# EasyEDA Pro project NavBot-EN01.epro, schematic OLED

## Sheets
1 P1: Board Name: OLED; Create Date: 2025-05-19; Page Name: P1; Project Name: NavBot-EN01; Schematic Name: Schematic1; Update Date: 2025-06-04; Company: 嘉立创EDA; Page Size: A4; Version: V1.0
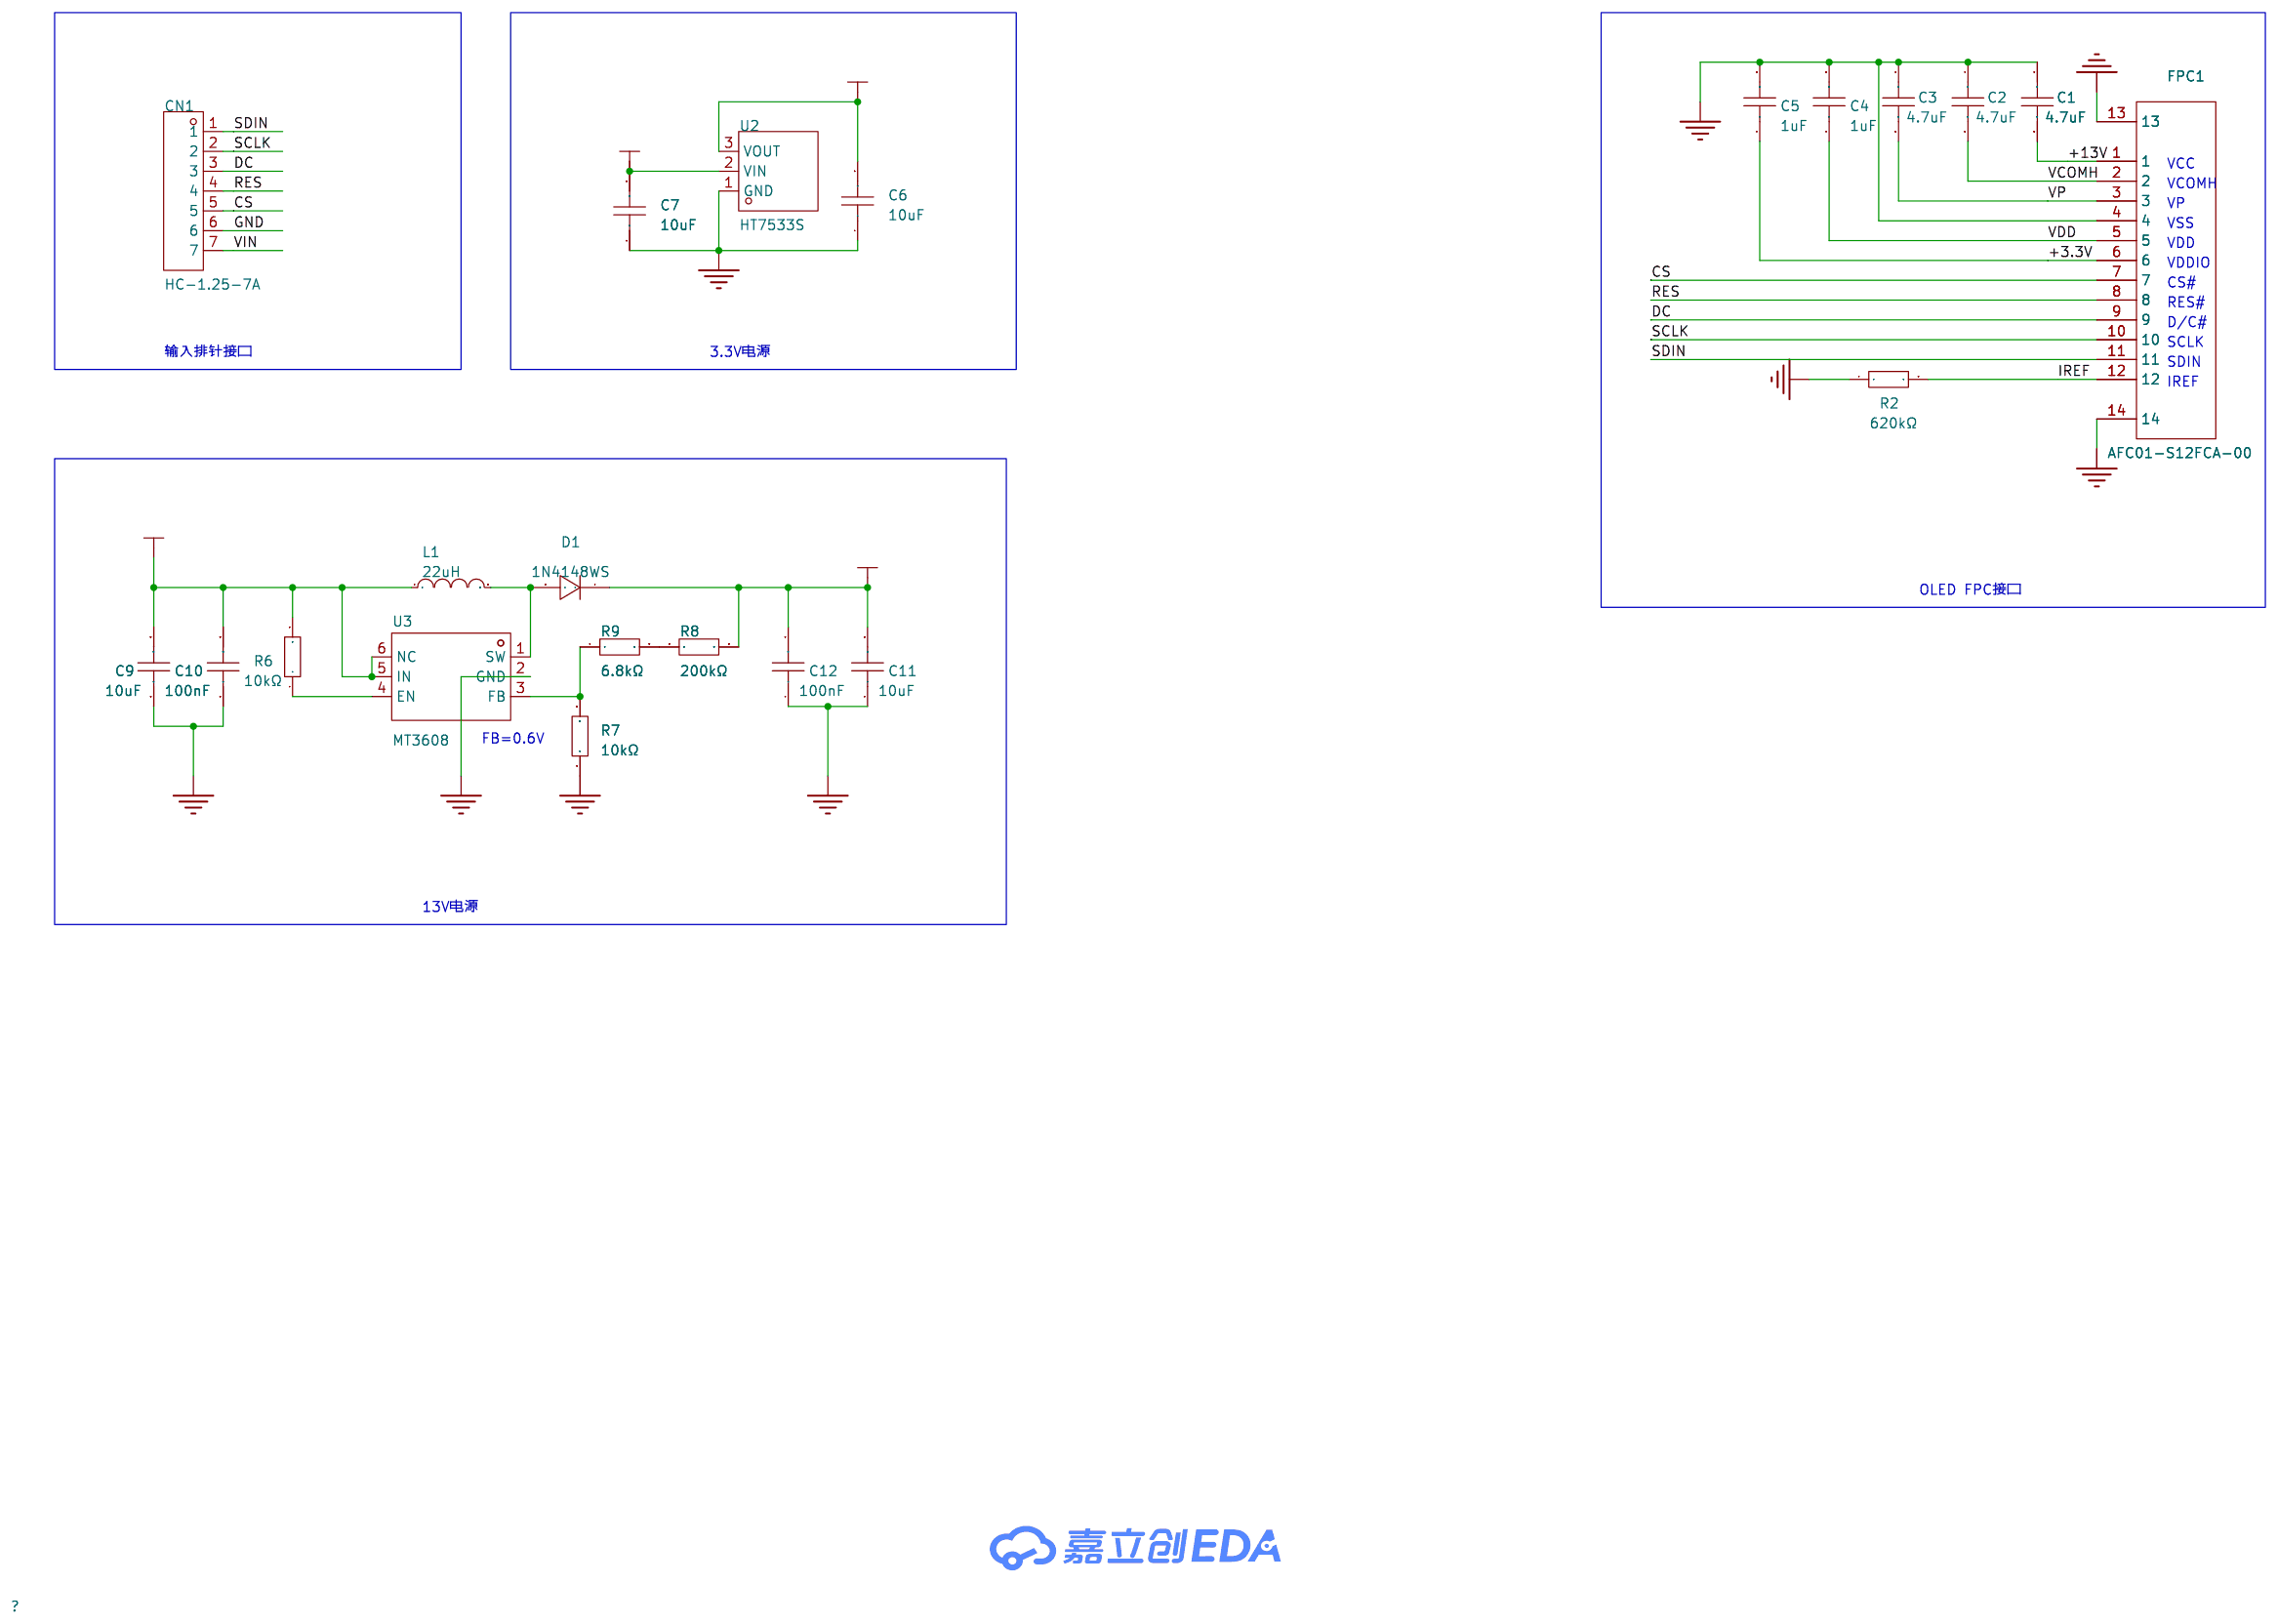
[diagram p2: P1]
2 版本说明: Create Date: 2025-07-21; Page Name: 版本说明; Schematic Name: OLED; Update Date: 2025-07-21
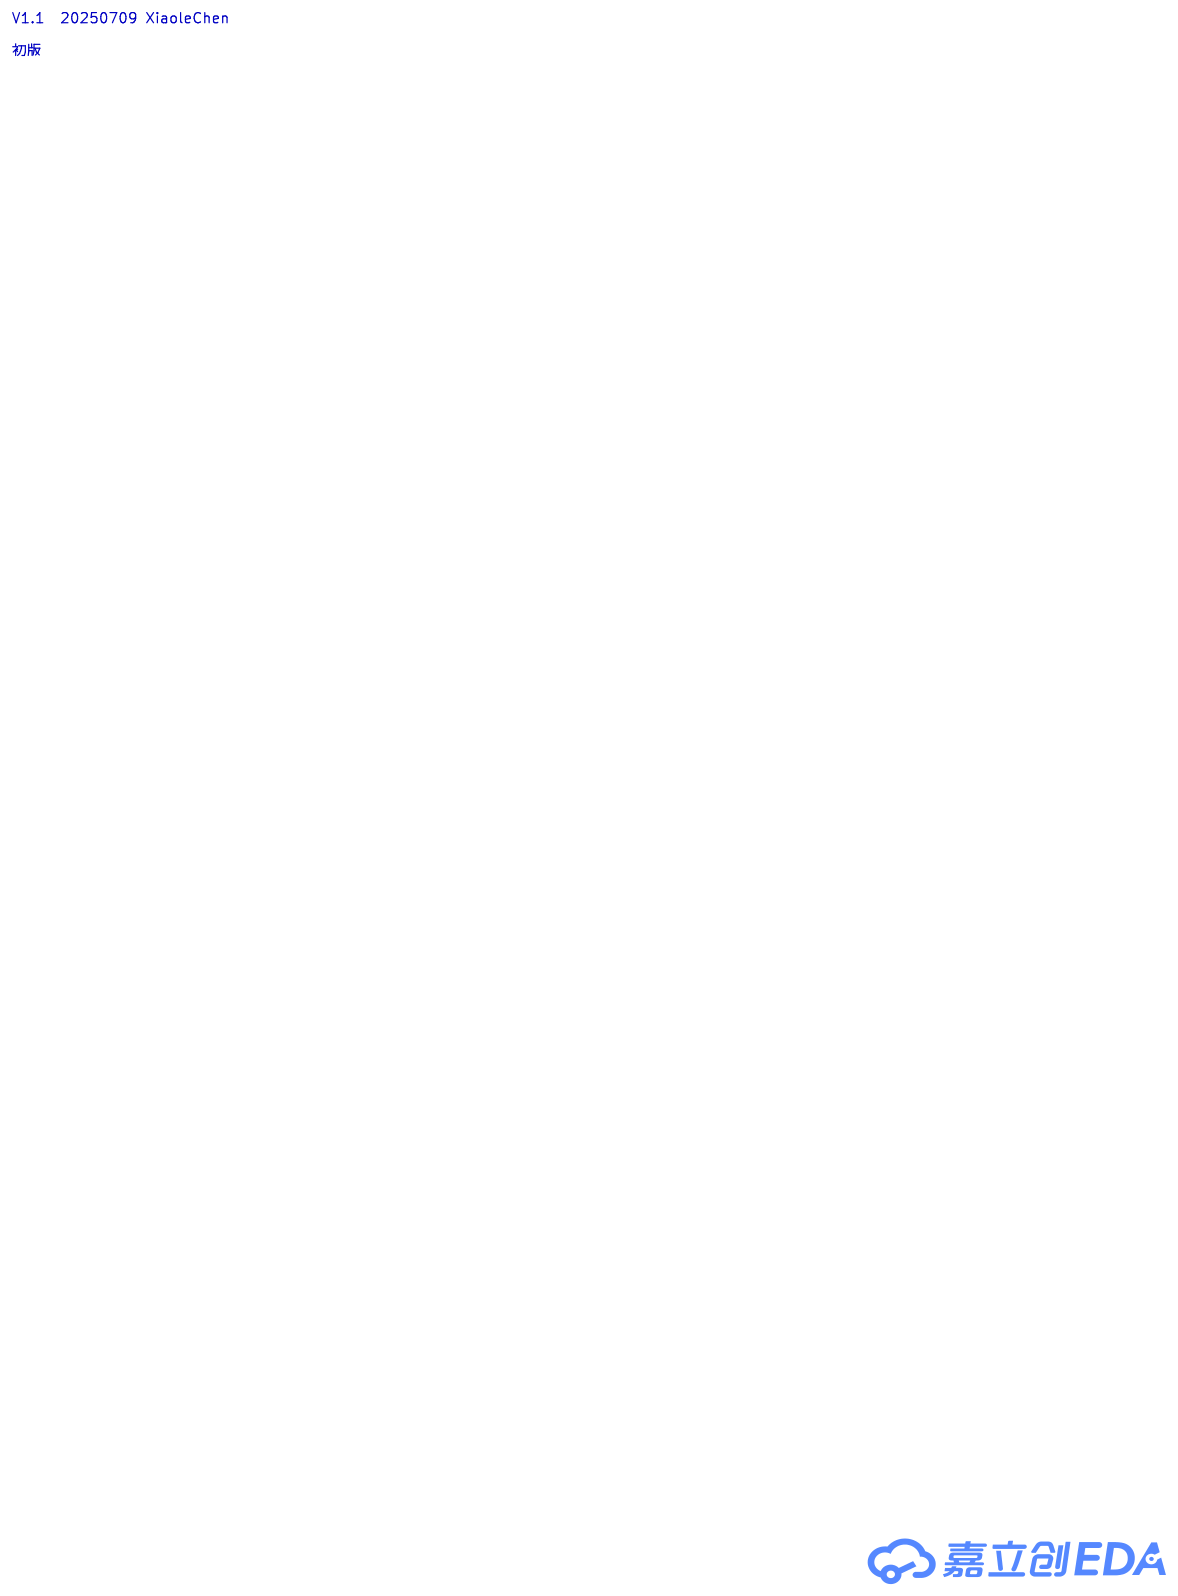
[diagram p3: 版本说明]

## Parts
C1  4.7uF  [C0603]
C2  4.7uF  [C0603]
C3  4.7uF  [C0603]
C4  1uF  [C0603]
C5  1uF  [C0603]
C6  10uF  [C0603]
C7  10uF  [C0603]
C9  10uF  [C0603]
C10  100nF  [C0603]
C11  10uF  [C0603]
C12  100nF  [C0603]
CN1  HC-1.25-7A  [CONN-TH_7P-P1.25_HCTL_HC-1.25-7A]
D1  1N4148WS  [SOD-323_L1.8-W1.3-LS2.5-RD]
FPC1  AFC01-S12FCA-00  [FPC-SMD_AFC01-S12FCA-00]
L1  22uH  [IND-SMD_L3.0-W3.0_FNR30XXS]
R2  620kΩ  [R0603]
R6  10kΩ  [R0603]
R7  10kΩ  [R0603]
R8  200kΩ  [R0603]
R9  6.8kΩ  [R0603]
U2  HT7533S  [SOT-23-3_L2.9-W1.5-P1.90-LS2.8-BR-CW]
U3  MT3608  [SOT-23-6_L2.9-W1.6-P0.95-LS2.8-BL]

## Library data of the parts
C1-C3 = CL10A475KO8NNNC: 容值:4.7uF;精度:±10%;额定电压:16V;材质(温度系数):X5R;; LCSC Part Name: 4.7uF ±10% 16V; Supplier Part: C19666; Manufacturer: SAMSUNG(三星); Supplier Footprint: 0603; JLCPCB Part Class: 基础库; Datasheet: https://atta.szlcsc.com/upload/public/pdf/source/20160218/1457707763339.pdf; Supplier: LCSC; Tolerance: ±10%; Voltage Rated: 16V; Temperature Coefficient: X5R
C4 C5 = CL10A105KB8NNNC: 容值:1uF;精度:±10%;额定电压:50V;材质(温度系数):X5R;; LCSC Part Name: 1uF ±10% 50V; Supplier Part: C15849; Manufacturer: SAMSUNG(三星); Supplier Footprint: 0603; JLCPCB Part Class: 基础库; Datasheet: https://atta.szlcsc.com/upload/public/pdf/source/20160218/1457707763339.pdf; Supplier: LCSC; Tolerance: ±10%; Voltage Rated: 50V; Temperature Coefficient: X5R
C6 C7 C9 C11 = CL10A106KP8NNNC: 容值:10uF;精度:±10%;额定电压:10V;材质(温度系数):X5R;; LCSC Part Name: 10uF ±10% 10V; Supplier Part: C19702; Manufacturer: SAMSUNG(三星); Supplier Footprint: 0603; JLCPCB Part Class: 基础库; Datasheet: https://atta.szlcsc.com/upload/public/pdf/source/20160218/1457707763339.pdf; Supplier: LCSC; Tolerance: ±10%; Voltage Rated: 10V; Temperature Coefficient: X5R
C10 C12 = CC0603KRX7R9BB104: 容值:100nF;精度:±10%;额定电压:50V;材质(温度系数):X7R;; LCSC Part Name: 100nF ±10% 50V; Supplier Part: C14663; Manufacturer: YAGEO(国巨); Supplier Footprint: 0603; JLCPCB Part Class: 基础库; Datasheet: https://atta.szlcsc.com/upload/public/pdf/source/20180910/C282072_33301C7F631E79921B82A8DAC6BCC5B3.pdf; Supplier: LCSC; Tolerance: ±10%; Voltage Rated: 50V; Temperature Coefficient: X7R
CN1 = HC-1.25-7A: 插针结构:1x7P;间距:1.25mm;安装方式:直插;参考系列:PicoBlade(MX 1.25);总PIN数:7P;排数:1;每排PIN数:7;行距:-;额定电流:1A;触头材质:黄铜;触头镀层:锡;工作温度范围:-25℃~+85℃;; LCSC Part Name: 1x7P 间距:1.25mm 直插 系列:PicoBlade(MX 1.25); Supplier Part: C2845525; Manufacturer: HCTL(华灿天禄); Supplier Footprint: 插件,P=1.25mm; JLCPCB Part Class: 扩展库; Datasheet: https://atta.szlcsc.com/upload/public/pdf/source/20230707/9C9BC153C15CECDA5FD17EC6041C1792.pdf; Supplier: LCSC; Pins Structure: 1x7P; Pitch: 1.25mm; Mounting Style: 直插; Reference Series: PicoBlade(MX 1.25); Number of Pins: 7P; Number of Rows: 1; Number of PINs Per Row: 7; Current Rating (Max): 1A; Contact Material: 黄铜; Contact Plating: 锡; Operating Temperature Range: -25℃~+85℃; Rated Voltage (Max): 125V; Plastic Material: PA46; Flame Retardant Rating: UL94V-0; Z-Height of the Board: 4.7mm; X-Length of Bottom Edge on Board (Spacing Line): 10.5mm; Y-Width of Bottom Edge on Board: 3.2mm
D1 = 1N4148WS_C2128: 二极管配置:独立式;正向压降(Vf):1.25V@150mA;直流反向耐压(Vr):100V;整流电流:150mA;反向恢复时间(Trr):4ns;; LCSC Part Name: 丝印T4 1N4148WS; Supplier Part: C2128; Manufacturer: CJ(江苏长电/长晶); Supplier Footprint: SOD-323; JLCPCB Part Class: 基础库; Datasheet: https://atta.szlcsc.com/upload/public/pdf/source/20140809/1457707208178.pdf; Supplier: LCSC; Diode Configuration: 独立式; Voltage - Forward(Vf@If): 1.25V@150mA; Voltage - DC Reverse(Vr): 100V; Current - Rectified: 150mA; Reverse Leakage Current (Ir): 1uA@75V; Reverse Recovery Time (trr): 4ns
FPC1 = AFC01-S12FCA-00: 锁定特性:翻盖式;触点类型:下接;触点数量:12P;间距:0.5mm;安装类型:卧贴;; LCSC Part Name: 间距:0.5mm P数:12P 翻盖式 下接; Supplier Part: C262661; Manufacturer: JS(钜硕电子); Supplier Footprint: SMD,P=0.5mm,卧贴; JLCPCB Part Class: 扩展库; Datasheet: https://atta.szlcsc.com/upload/public/pdf/source/20190816/C413942_2A72D1AC756EAE17EEDF756A339D4500.pdf; Supplier: LCSC; Locking Feature: 翻盖式; Contact Type: 下接; Number of Contacts: 12P; Pitch: 0.5mm; Mounting Type: 卧贴; FFC, FCB Thickness: 0.3mm; Height Above Board: 2mm
L1 = FNR3015S220MT: 电感值:22uH;精度:±20%;额定电流:690mA;饱和电流(Isat):680mA;; LCSC Part Name: 22uH ±20% 680mA; Supplier Part: C167761; Manufacturer: cjiang(长江微电); Supplier Footprint: SMD,3x3mm; JLCPCB Part Class: 扩展库; Datasheet: https://atta.szlcsc.com/upload/public/pdf/source/20190327/C167925_9EFF0AABC4CA629C2CC95961DBF7D39D.pdf; Supplier: LCSC; Tolerance: ±20%; Rated Current: 690mA; Saturation Current (Isat): 680mA; DC Resistance (DCR): 598mΩ
R2 = 0603WAF6203T5E: 电阻类型:厚膜电阻;阻值:620kΩ;精度:±1%;功率:100mW;最大工作电压:75V;温度系数:±100ppm/℃;; LCSC Part Name: 620kΩ ±1% 100mW 厚膜电阻; Supplier Part: C23219; Manufacturer: UNI-ROYAL(厚声); Supplier Footprint: 0603; JLCPCB Part Class: 扩展库; Datasheet: https://atta.szlcsc.com/upload/public/pdf/source/20200306/C422600_1E6D84923E4A46A82E41ADD87F860B5C.pdf; Supplier: LCSC; Type: 厚膜电阻; Tolerance: ±1%; Power(Watts): 100mW; Overload Voltage (Max): 75V; Temperature Coefficient: ±100ppm/℃; Operating Temperature Range: -55℃~+155℃
R6 R7 = 0603WAF1002T5E: 电阻类型:厚膜电阻;阻值:10kΩ;精度:±1%;功率:100mW;最大工作电压:75V;温度系数:±100ppm/℃;; LCSC Part Name: 厚膜电阻 10kΩ ±1% 100mW; Supplier Part: C25804; Manufacturer: UNI-ROYAL(厚声); Supplier Footprint: 0603; JLCPCB Part Class: 基础库; Datasheet: https://atta.szlcsc.com/upload/public/pdf/source/20200306/C422600_1E6D84923E4A46A82E41ADD87F860B5C.pdf; Supplier: LCSC; Type: 厚膜电阻; Tolerance: ±1%; Power(Watts): 100mW; Overload Voltage (Max): 75V; Temperature Coefficient: ±100ppm/℃; Operating Temperature Range: -55℃~+155℃
R8 = 0603WAF2003T5E: 电阻类型:厚膜电阻;阻值:200kΩ;精度:±1%;功率:100mW;最大工作电压:75V;温度系数:±100ppm/℃;; LCSC Part Name: 200kΩ ±1% 100mW 厚膜电阻; Supplier Part: C25811; Manufacturer: UNI-ROYAL(厚声); Supplier Footprint: 0603; JLCPCB Part Class: 基础库; Datasheet: https://atta.szlcsc.com/upload/public/pdf/source/20200306/C422600_1E6D84923E4A46A82E41ADD87F860B5C.pdf; Supplier: LCSC; Type: 厚膜电阻; Tolerance: ±1%; Power(Watts): 100mW; Overload Voltage (Max): 75V; Temperature Coefficient: ±100ppm/℃; Operating Temperature Range: -55℃~+155℃
R9 = 0603WAF6801T5E: 电阻类型:厚膜电阻;阻值:6.8kΩ;精度:±1%;功率:100mW;最大工作电压:75V;温度系数:±100ppm/℃;; LCSC Part Name: 6.8kΩ ±1% 100mW 厚膜电阻; Supplier Part: C23212; Manufacturer: UNI-ROYAL(厚声); Supplier Footprint: 0603; JLCPCB Part Class: 基础库; Datasheet: https://atta.szlcsc.com/upload/public/pdf/source/20200306/C422600_1E6D84923E4A46A82E41ADD87F860B5C.pdf; Supplier: LCSC; Type: 厚膜电阻; Tolerance: ±1%; Power(Watts): 100mW; Overload Voltage (Max): 75V; Temperature Coefficient: ±100ppm/℃; Operating Temperature Range: -55℃~+155℃
U2 = HT7533S: 输出类型:固定;工作电压:30V;输出电压:3.3V;输出电流:100mA;电源纹波抑制比(PSRR):-;输出极性:正极;; LCSC Part Name: 输入30V 输出3.3V 100mA; Supplier Part: C347215; Manufacturer: UMW(友台半导体); Supplier Footprint: SOT-23; JLCPCB Part Class: 扩展库; Datasheet: https://atta.szlcsc.com/upload/public/pdf/source/20241210/442D8F583BE08BBCCA568BF38D964031.pdf; Supplier: LCSC; Output Type: 固定; Maximum Input Voltage: 30V; Output Voltage: 3.3V; Output Current: 100mA; Dropout Voltage: 200mV; standby current: 3uA; Feature: 过热保护; Operating Temperature: -40℃~+85℃; Output Polarity: 正极; Number of Outputs: 1
U3 = MT3608: 功能类型:升压型;输出类型:可调;工作电压:2V~24V;输出电压:28V;输出电流:2A;; LCSC Part Name: 高效1.2MHz 2A升压转换器; Supplier Part: C84817; Manufacturer: 西安航天民芯; Supplier Footprint: SOT-23-6; JLCPCB Part Class: 扩展库; Datasheet: https://atta.szlcsc.com/upload/public/pdf/source/20161110/1478743351706.pdf; Supplier: LCSC; Function: 升压型; Output Type: 可调; Input Voltage: 2V~24V; Output Voltage: 28V; Output Current: 2A; Switching Frequency: 1.2MHz; Operating Temperature: -40℃~+85℃; Synchronous Rectification: 否; Number of Outputs: 1; Topology: 升压式; Quiescent Current (Iq): 200uA; Switch tube (built-in/external): 内置

## Nets
+3.3V: C5.1 C6.2 FPC1.6 U2.3(VOUT)
+13V: C1.2 C11.2 C12.2 D1.1(K) FPC1.1 R8.2
GND: C1.1 C2.1 C3.1 C4.2 C5.2 C6.1 C7.1 C9.1 C10.1 C11.1 C12.1 CN1.6 FPC1.4 FPC1.13 FPC1.14 R2.1 R7.1 U2.1(GND) U3.2(GND)
VDD: C4.1 FPC1.5
VIN: C7.2 C9.2 C10.2 CN1.7 L1.1 R6.2 U2.2(VIN) U3.5(IN) U3.6(NC)
CS: CN1.5 FPC1.7
DC: CN1.3 FPC1.9
IREF: FPC1.12 R2.2
RES: CN1.4 FPC1.8
SCLK: CN1.2 FPC1.10
SDIN: CN1.1 FPC1.11
VCOMH: C2.2 FPC1.2
VP: C3.2 FPC1.3
$1N2453: R6.1 U3.4(EN)
$1N2469: D1.2(A) L1.2 U3.1(SW)
$1N2861: R8.1 R9.2
$1N2983: R7.2 R9.1 U3.3(FB)

## Notes on the sheets
sheet 1
- VCC
- VCOMH
- VP
- VSS
- VDD
- VDDIO
- CS#
- RES#
- D/C#
- SCLK
- 输入排针接口
- 3.3V电源
- SDIN
- IREF
- OLED FPC接口
- FB=0.6V
- 13V电源
sheet 2
- V1.1  20250709 XiaoleChen
  初版
